# Altium schematic sheet Serial Comms.SchDoc
size A4; DrawnBy: Craig Comberbach; DocumentNumber: 7; Revision: A1; SheetNumber: 7; SheetTotal: 7
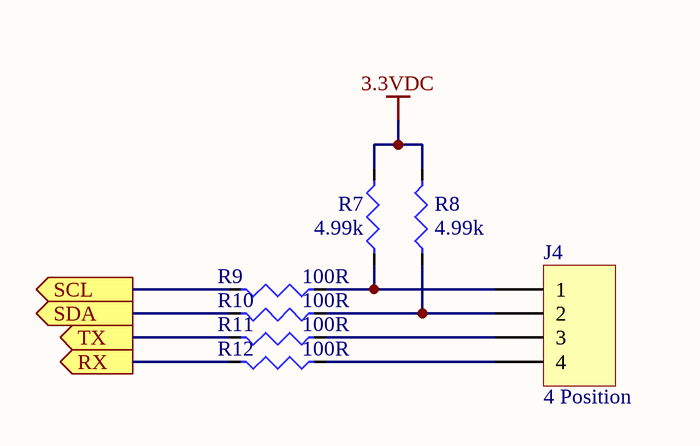
[diagram p0: Serial Comms.SchDoc]

## Parts
J4  QuickValue: 4 Position  [4POS TBLOCK_REV2]  (hidden comment: MTA 100 - 4 Position)
R7  QuickValue: 4.99k  [RESISTOR THT 3W 0.05HOLE 900MIL]  (hidden comment: Resistor)
R8  QuickValue: 4.99k  [RESISTOR THT 3W 0.05HOLE 900MIL]  (hidden comment: Resistor)
R9  QuickValue: 100R  [Resistor - 0603]  (hidden comment: Resistor)
R10  QuickValue: 100R  [Resistor - 0603]  (hidden comment: Resistor)
R11  QuickValue: 100R  [Resistor - 0603]  (hidden comment: Resistor)
R12  QuickValue: 100R  [Resistor - 0603]  (hidden comment: Resistor)

## Ports
RX (out), SCL (out), SDA (out), TX (out)

## Nets
3.3VDC: R7.2 R8.2
RX: R12.2 ; port RX
SCL: R9.2 ; port SCL
SDA: R10.2 ; port SDA
TX: R11.2 ; port TX
NetJ4_1: J4.1 R7.1 R9.1
NetJ4_2: J4.2 R8.1 R10.1
NetJ4_3: J4.3 R11.1
NetJ4_4: J4.4 R12.1

## Library data of the parts
J4 = Header 4: Header, 4-Pin; Technology: THT; Value: MTA 100 - 4 Position; Package: MTA-100; Supplier 1: Digi-Key; Supplier Part Number 1: A1922-ND
R7 R8 = Resistor: Value: 4.99k 1/4W 1%; Tolerance: 1%; Technology: THT; Supplier 1: Digi-Key; Supplier Part Number 1: 4.99KXBK-ND; Package: 1/4W
R9-R12 = Resistor: Value: 100R 1/4W 1%; Tolerance: 1%; Technology: THT; Supplier 1: Digi-Key; Supplier Part Number 1: 100XBK-ND; Package: 1/4W